# Altium schematic sheet Daughterboard.SchDoc: Digital Daughterboard
size 420 x 297 mm; Date: 03/16/2022; Author: Mamoon Syed; CompanyName: UF PSSL; DrawnBy: Mamoon Syed; Engineer: Mamoon Syed; Organization: University of Florida; DocumentNumber: 1; Revision: 1; SheetNumber: 1; SheetTotal: 1; Time: 1:25 PM; ImagePath: C:\Users\m.syed\Documents\Projects\Electronics Design\Assets\pssl-tag-large.png
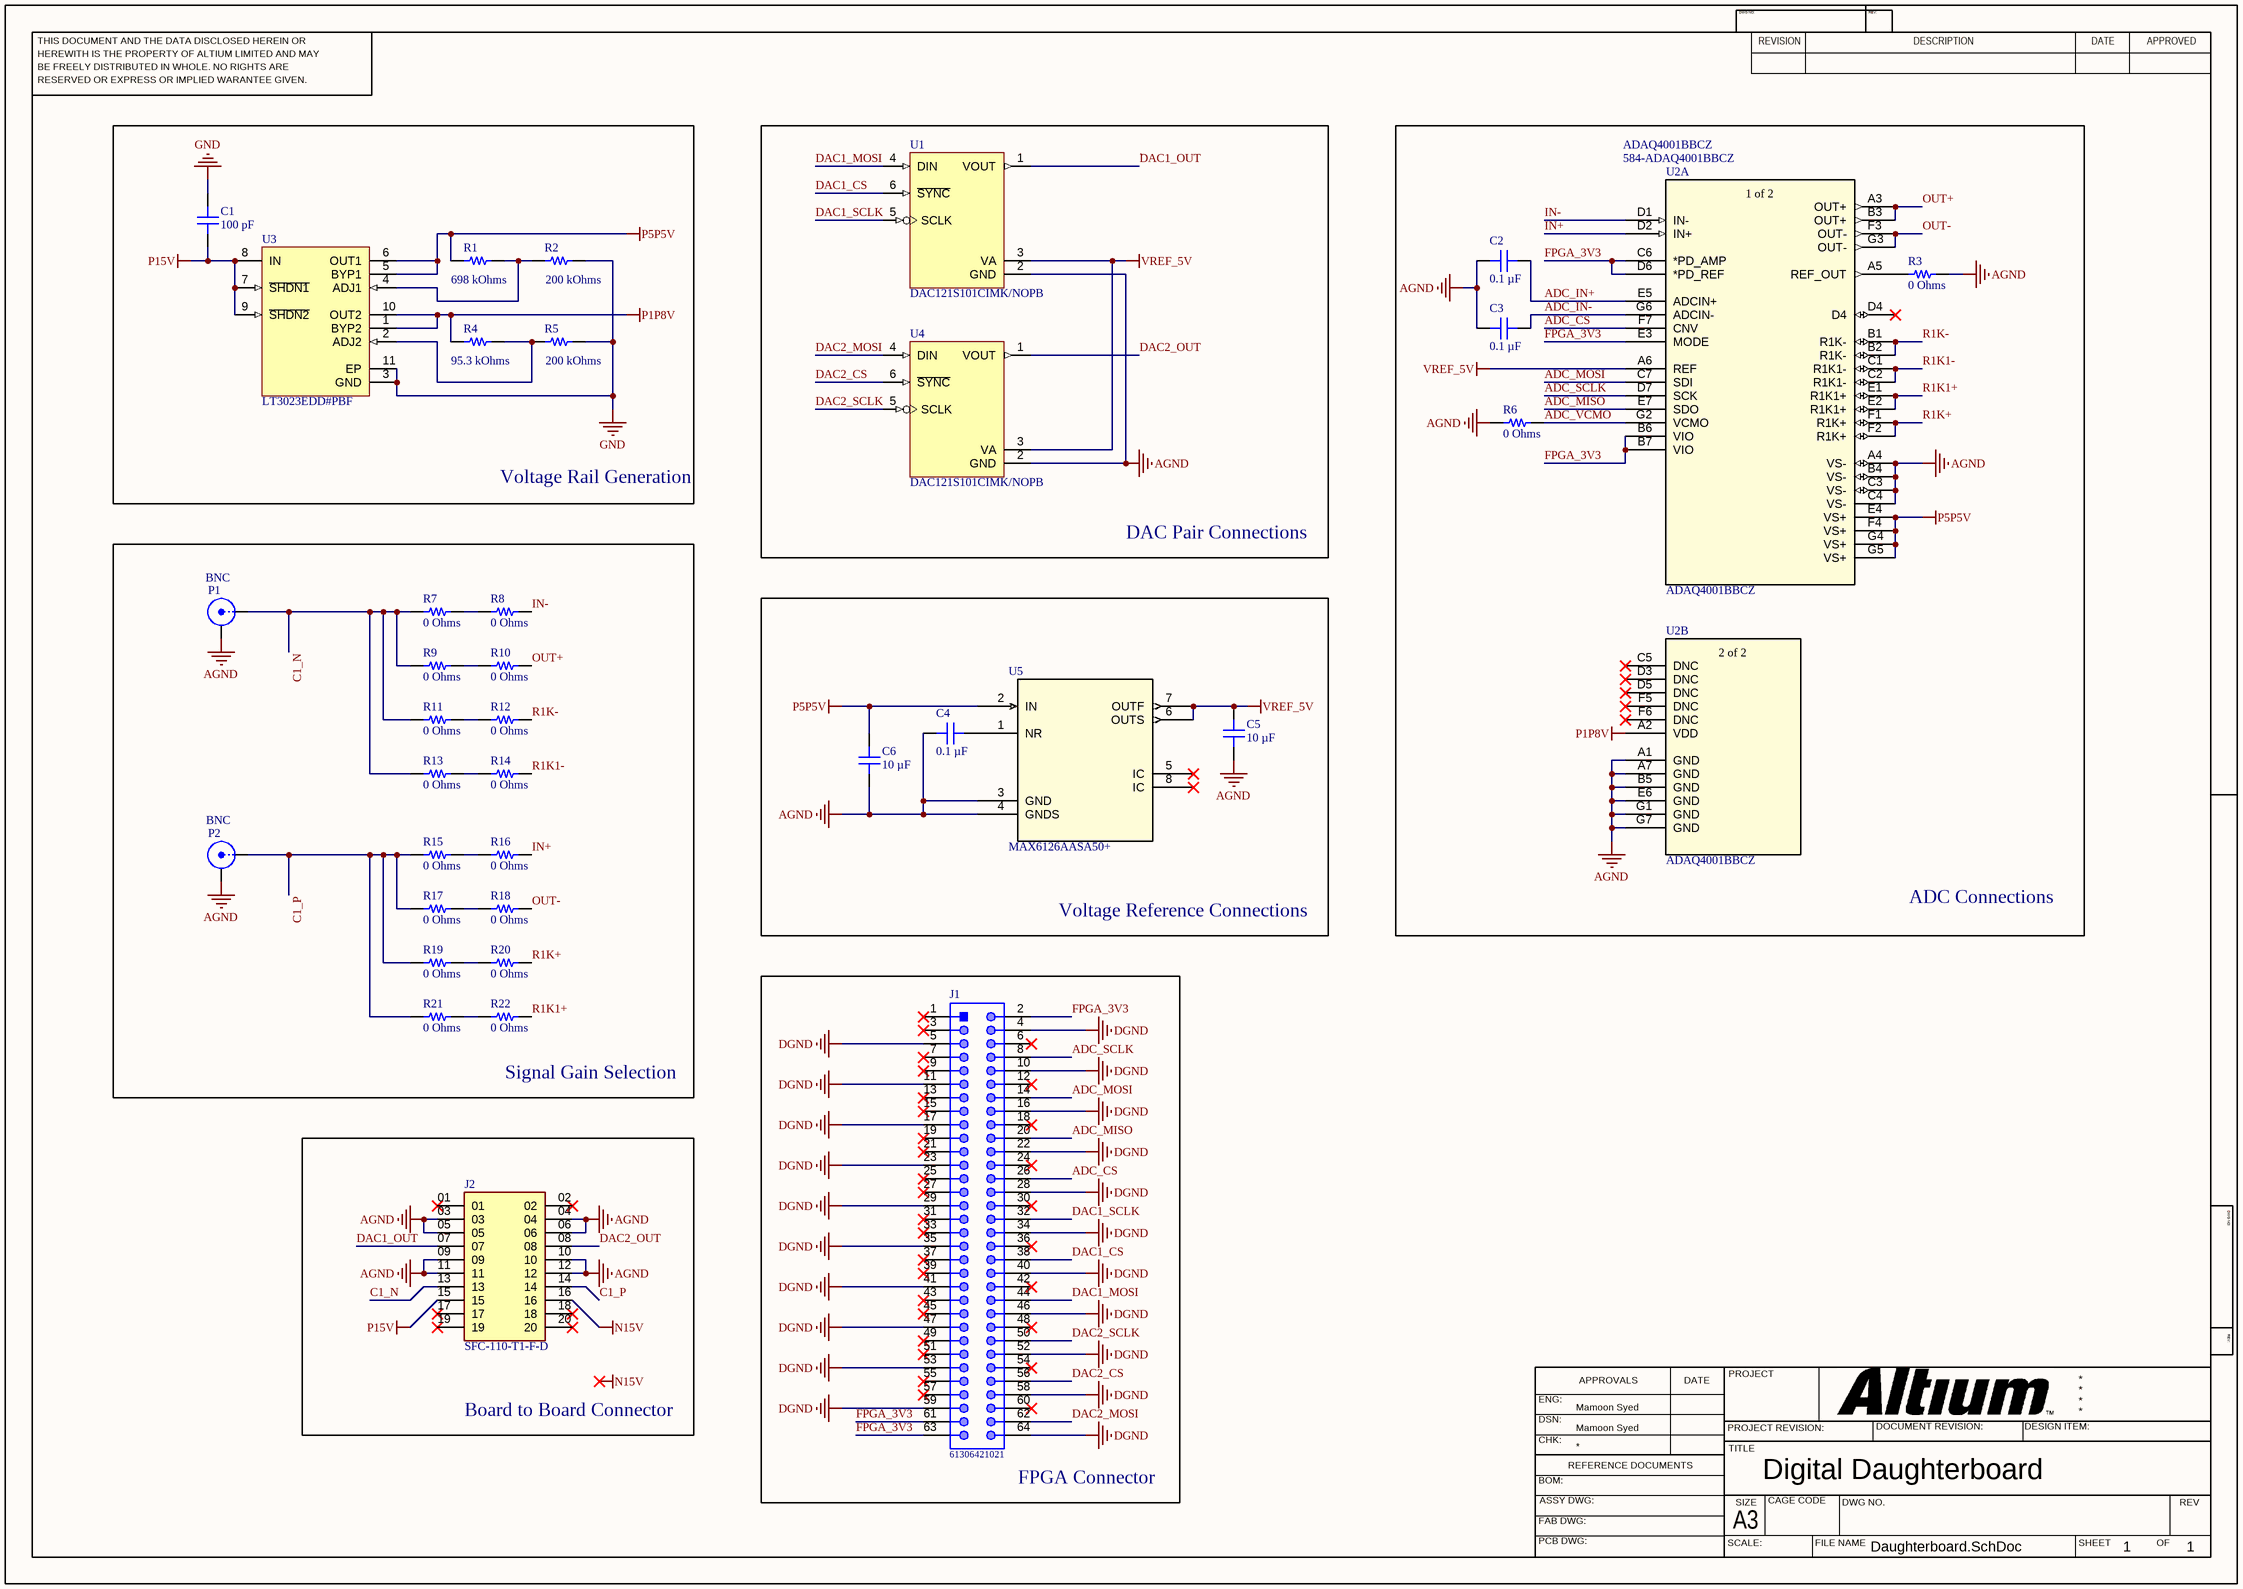
[diagram p0: Daughterboard.SchDoc]

## Parts
C1  100 pF  [CAP 0603_1608]
C2  0.1 µF  [CAP 0603_1608]
C3  0.1 µF  [CAP 0603_1608]
C4  0.1 µF  [CAP 0603_1608]
C5  10 µF  [CAP 0603_1608]
C6  10 µF  [CAP 0603_1608]
J1  61306421021  [61306421021]
J2  SFC-110-T1-F-D  [SAMTEC_SFC-110-T1-F-D]
P1  BNC  [BNC_RA CON]
P2  BNC  [BNC_RA CON]
R1  698 kOhms  [RES 0603_1608]
R2  200 kOhms  [RES 0603_1608]
R3  0 Ohms  [RES 0603_1608]
R4  95.3 kOhms  [RES 0603_1608]
R5  200 kOhms  [RES 0603_1608]
R6  0 Ohms  [RES 0603_1608]
R7  0 Ohms  [RES 0603_1608]
R8  0 Ohms  [RES 0603_1608]
R9  0 Ohms  [RES 0603_1608]
R10  0 Ohms  [RES 0603_1608]
R11  0 Ohms  [RES 0603_1608]
R12  0 Ohms  [RES 0603_1608]
R13  0 Ohms  [RES 0603_1608]
R14  0 Ohms  [RES 0603_1608]
R15  0 Ohms  [RES 0603_1608]
R16  0 Ohms  [RES 0603_1608]
R17  0 Ohms  [RES 0603_1608]
R18  0 Ohms  [RES 0603_1608]
R19  0 Ohms  [RES 0603_1608]
R20  0 Ohms  [RES 0603_1608]
R21  0 Ohms  [RES 0603_1608]
R22  0 Ohms  [RES 0603_1608]
U1  DAC121S101CIMK/NOPB  [MK06A_N]
U2  ADAQ4001BBCZ  Supplier Part Number 1: 584-ADAQ4001BBCZ  [BGA49_ADAQ4001BBCZ_ADI]  (parts A,B of 2)
U3  LT3023EDD#PBF  [LT-DD-10_V]
U4  DAC121S101CIMK/NOPB  [MK06A_N]
U5  MAX6126AASA50+  [21-0041B_8]

## Blocks framed on the sheet
Voltage Rail Generation: C1 R1 R2 R4 R5 U3
DAC Pair Connections: U1 U4
ADC Connections: C2 C3 R3 R6 U2
Signal Gain Selection: P1 P2 R7-R22
Voltage Reference Connections: C4-C6 U5
FPGA Connector: J1
Board to Board Connector: J2

## Nets
AGND: C2.1 C3.1 C4.1 C5.1 C6.1 J2.03 J2.04 J2.05 J2.06 J2.09 J2.10 J2.11 J2.12 P1.2(Y) P2.2(Y) R3.2 R6.1 U1.2(GND) U2.A1(GND) U2.A4(VS-) U2.A7(GND) U2.B4(VS-) U2.B5(GND) U2.C3(VS-) U2.C4(VS-) U2.E6(GND) U2.G1(GND) U2.G7(GND) U4.2(GND) U5.3(GND) U5.4(GNDS)
DGND: J1.4 J1.5 J1.10 J1.11 J1.16 J1.17 J1.22 J1.23 J1.28 J1.29 J1.34 J1.35 J1.40 J1.41 J1.46 J1.47 J1.52 J1.53 J1.58 J1.59 J1.64
GND: C1.2 R2.2 R5.2 U3.3(GND) U3.11(EP)
N15V: J2.16
P1P8V: R4.1 U2.A2(VDD) U3.1(BYP2) U3.10(OUT2)
P5P5V: C6.2 R1.1 U2.E4(VS+) U2.F4(VS+) U2.G4(VS+) U2.G5(VS+) U3.5(BYP1) U3.6(OUT1) U5.2(IN)
P15V: C1.1 J2.15 U3.7(~{SHDN1}) U3.8(IN) U3.9(~{SHDN2})
VREF_5V: C5.2 U1.3(VA) U2.A6(REF) U4.3(VA) U5.6(OUTS) U5.7(OUTF)
`: J2.07 U1.1(VOUT)  [also labelled DAC1_OUT]
ADC_CS: J1.26 U2.F7(CNV)
ADC_IN+: C2.2 U2.E5(ADCIN+)
ADC_IN-: C3.2 U2.G6(ADCIN-)
ADC_MISO: J1.20 U2.E7(SDO)
ADC_MOSI: J1.14 U2.C7(SDI)
ADC_SCLK: J1.8 U2.D7(SCK)
ADC_VCMO: R6.2 U2.G2(VCMO)
C1_N: J2.13 P1.1(X) R7.1 R9.1 R11.1 R13.1
C1_P: J2.14 P2.1(X) R15.1 R17.1 R19.1 R21.1
DAC1_CS: J1.38 U1.6(~{SYNC})
DAC1_MOSI: J1.44 U1.4(DIN)
DAC1_SCLK: J1.32 U1.5(SCLK)
DAC2_CS: J1.56 U4.6(~{SYNC})
DAC2_MOSI: J1.62 U4.4(DIN)
DAC2_OUT: J2.08 U4.1(VOUT)
DAC2_SCLK: J1.50 U4.5(SCLK)
FPGA_3V3: J1.2 J1.61 J1.63 U2.B6(VIO) U2.B7(VIO) U2.C6(*PD_AMP) U2.D6(*PD_REF) U2.E3(MODE)
IN+: R16.2 U2.D2(IN+)
IN-: R8.2 U2.D1(IN-)
OUT+: R10.2 U2.A3(OUT+) U2.B3(OUT+)
OUT-: R18.2 U2.F3(OUT-) U2.G3(OUT-)
R1K1+: R22.2 U2.E1(R1K1+) U2.E2(R1K1+)
R1K1-: R14.2 U2.C1(R1K1-) U2.C2(R1K1-)
R1K+: R20.2 U2.F1(R1K+) U2.F2(R1K+)
R1K-: R12.2 U2.B1(R1K-) U2.B2(R1K-)
NetC4_2: C4.2 U5.1(NR)
NetR1_2: R1.2 R2.1 U3.4(ADJ1)
NetR3_1: R3.1 U2.A5(REF_OUT)
NetR4_2: R4.2 R5.1 U3.2(ADJ2)
NetR7_2: R7.2 R8.1
NetR9_2: R9.2 R10.1
NetR11_2: R11.2 R12.1
NetR13_2: R13.2 R14.1
NetR15_2: R15.2 R16.1
NetR17_2: R17.2 R18.1
NetR19_2: R19.2 R20.1
NetR21_2: R21.2 R22.1

Not connected (* = marked no-connect by the designer): J1 1* 3* 6* 7* 9* 12* 13* 15* 18* 19* 21* 24* 25* 27* 30* 31* 33* 36* 37* 39* 42* 43* 45* 48* 49* 51* 54* 55* 57* 60*; J2 01* 02* 17* 18* 19* 20*; U2 C5(DNC)* D3(DNC)* D4* D5(DNC)* F5(DNC)* F6(DNC)*; U5 5(IC)* 8(IC)*

## Notes on the sheet
- Labels drawn without touching a wire or pin: N15V
- THIS DOCUMENT AND THE DATA DISCLOSED HEREIN OR
- HEREWITH IS THE PROPERTY OF ALTIUM LIMITED AND MAY
- DWG NO:
- REVISION
- REV:
- DESCRIPTION
- DATE
- APPROVED
- BE FREELY DISTRIBUTED IN WHOLE. NO RIGHTS ARE
- RESERVED OR EXPRESS OR IMPLIED WARANTEE GIVEN.
- ENG:
- APPROVALS
- PROJECT
- DSN:
- CHK:
- REFERENCE DOCUMENTS
- PROJECT REVISION:
- TITLE
- DOCUMENT REVISION:
- DESIGN ITEM:
- BOM:
- FAB DWG:
- PCB DWG:
- ASSY DWG:
- SCALE:
- A3
- SIZE
- CAGE CODE
- FILE NAME
- DWG NO.
- SHEET
- OF
- REV
- (in symbol ADAQ4001BBCZ, part A) 1 of 2
- (in symbol ADAQ4001BBCZ, part B) 2 of 2

## Library data of the parts
C1 = C0603C101K5GACAUTO: CAP CER 100PF 50V C0G/NP0 0603; manufacturer: KEMET; Temperature Coefficient: C0G, NP0; Tolerance: ±10%; Part Number: C0603C101K5GACAUTO; Value: 100 pF; Applications: Automotive; Capacitance: 100 pF; componentlink1description: Datasheet; componentlink1url: https://api.kemet.com/component-edge/download/datasheet/C0603C101K5GACAUTO.pdf; componentlink2description: DigiKey Link; componentlink2url: https://www.digikey.com/en/products/detail/kemet/C0603C101K5GACAUTO/3314842; Device Package: 0603 (1608 Metric); Features: Low ESL; lastupdated: 4/12/2022 10:08:31 PM; Lifecycle Status: Active; Minimum Order: 1; Mounting Type: Surface Mount, MLCC; Operating Temperature: -55°C ~ 125°C; Package / Case: 0603 (1608 Metric); packaging: TapeAndReel; partid: 2201; Part Status: Active; price: 0.02; Ratings: AEC-Q200; series: SMD Auto C0G; Size / Dimension: 0.063" L x 0.031" W (1.60mm x 0.80mm); Supplier 1: DigiKey; Supplier Part Number 1: 399-6843-1-ND; Thickness (Max): 0.034" (0.87mm); Voltage - Rated: 50V
C2-C4 = C0603C104K5RAC7411: CAP CER 0.1UF 50V X7R 0603; manufacturer: KEMET; Tolerance: ±10%; Part Number: C0603C104K5RAC7411; Value: 0.1 µF; Applications: Bypass, Decoupling; Capacitance: 0.1 µF; componentlink1description: Datasheet; componentlink1url: https://api.kemet.com/component-edge/download/datasheet/C0603C104K5RAC7411.pdf; componentlink2description: DigiKey Link; componentlink2url: https://www.digikey.com/en/products/detail/kemet/C0603C104K5RAC7411/3317013; Device Package: 0603 (1608 Metric); lastupdated: 4/12/2022 10:08:31 PM; Lifecycle Status: Active; Minimum Order: 15000; Mounting Type: Surface Mount, MLCC; Operating Temperature: -55°C ~ 125°C; Package / Case: 0603 (1608 Metric); packaging: TapeAndReel; partid: 2233; Part Status: Active; price: 0.01; series: SMD Comm X7R; Size / Dimension: 0.063" L x 0.031" W (1.60mm x 0.80mm); Supplier 1: DigiKey; Supplier Part Number 1: 399-7374-2-ND; Temperature Coefficient: X7R; Thickness (Max): 0.035" (0.90mm); Voltage - Rated: 50V
C5 C6 = GRM188R60J106ME47D: CAP CER 10UF 6.3V X5R 0603; manufacturer: Murata Electronics; Tolerance: ±20%; Part Number: GRM188R60J106ME47D; Value: 10 µF; Applications: General Purpose; Capacitance: 10 µF; componentlink1description: Datasheet; componentlink1url: https://www.murata.com/~/media/webrenewal/support/library/catalog/products/capacitor/mlcc/c02e.ashx?la=en-us; componentlink2description: DigiKey Link; componentlink2url: https://www.digikey.com/en/products/detail/murata-electronics/GRM188R60J106ME47D/965910; Device Package: 0603 (1608 Metric); lastupdated: 4/12/2022 10:08:30 PM; Lifecycle Status: Active; Minimum Order: 1; Mounting Type: Surface Mount, MLCC; Operating Temperature: -55°C ~ 85°C; Package / Case: 0603 (1608 Metric); packaging: TapeAndReel; partid: 2351; Part Status: Active; price: 0.03; series: GRM; Size / Dimension: 0.063" L x 0.031" W (1.60mm x 0.80mm); Supplier 1: DigiKey; Supplier Part Number 1: 490-3896-1-ND; Temperature Coefficient: X5R; Thickness (Max): 0.035" (0.90mm); Voltage - Rated: 6.3V
J1 = CMP-1502-01137-1: THT Angled Pin Header WR-PHD, Pitch 2.54 mm, Dual Row, 64 pins; Manufacturer: Wurth Elektronik; Working Voltage: 250VAC; Contact Resistance: 20mOhm; Rated Current: 3A; Pitch: 2.54mm; Pin Number: 64; Gender: Male; Withstanding Voltage: 500VAC; Row Number: Dual; Datasheet URL: https://katalog.we-online.de/em/datasheet/6130xx21021.pdf; Packaging: Bag; Package Reference: 61306421021; Part Number: 61306421021; Mounting Technology: THT; Manufacturer URL: http://www.we-online.de; Orientation: Angled; Publisher: WurthElektronik; Operating Temperature: -40to105degC
P1 P2 = BNC: BNC Elbow Connector; LatestRevisionDate: 17-Jul-2002; LatestRevisionNote: Re-released for DXP Platform.; Publisher: Altium Limited
R1 = RC0603FR-07698KL: RES 698K OHM 1% 1/10W 0603; Manufacturer: Yageo; Power (Watts): 0.1W, 1/10W; Temperature Coefficient: ±100ppm/°C; Part Number: RC0603FR-07698KL; Value: 698 kOhms; ComponentLink1Description: Datasheet; ComponentLink1URL: https://www.yageo.com/upload/media/product/productsearch/datasheet/rchip/PYu-RC_Group_51_RoHS_L_10.pdf; ComponentLink2Description: DigiKey Link; ComponentLink2URL: https://www.digikey.com/en/products/detail/yageo/RC0603FR-07698KL/727362; Composition: Thick Film; Device Package: 0603 (1608 Metric); Features: Moisture Resistant; Height - Seated (Max): 0.022" (0.55mm); LastUpdated: 4/12/2022 10:26:44 PM; Lifecycle Status: Active; Minimum Order: 1; Number of Terminations: 2; Operating Temperature: -55°C ~ 155°C; Package / Case: 0603 (1608 Metric); Packaging: CutTape; PartId: 22804; Part Status: Active; Price: 0.01; Resistance: 698 kOhms; Series: RC_L; Size / Dimension: 0.063" L x 0.031" W (1.60mm x 0.80mm); Supplier 1: DigiKey; Supplier Part Number 1: 311-698KHRCT-ND; Supplier Device Package: 0603; Tolerance: ±1%
R2 R5 = RK73B1JTTD204J: RES 200K OHM 5% 1/10W 0603; Manufacturer: KOA Speer Electronics, Inc.; Power (Watts): 0.1W, 1/10W; Temperature Coefficient: ±200ppm/°C; Part Number: RK73B1JTTD204J; Value: 200 kOhms; ComponentLink1Description: Datasheet; ComponentLink1URL: http://www.koaspeer.com/catimages/Products/RK73B/RK73B.pdf; ComponentLink2Description: DigiKey Link; ComponentLink2URL: https://www.digikey.com/en/products/detail/koa-speer-electronics-inc/RK73B1JTTD204J/9844774; Composition: Thick Film; Device Package: 0603 (1608 Metric); Features: Automotive AEC-Q200; Height - Seated (Max): 0.022" (0.55mm); LastUpdated: 4/12/2022 10:27:51 PM; Lifecycle Status: Active; Minimum Order: 1; Number of Terminations: 2; Operating Temperature: -55°C ~ 155°C; Package / Case: 0603 (1608 Metric); Packaging: CutTape; PartId: 6049; Part Status: Active; Price: 0.01; Ratings: AEC-Q200; Resistance: 200 kOhms; Series: RK73B; Size / Dimension: 0.063" L x 0.031" W (1.60mm x 0.80mm); Supplier 1: DigiKey; Supplier Part Number 1: 2019-RK73B1JTTD204JCT-ND; Supplier Device Package: 0603; Tolerance: ±5%
R3 R6-R22 = AC0603JR-070RL: RES SMD 0 OHM JUMPER 1/10W 0603; Manufacturer: Yageo; Power (Watts): 0.1W, 1/10W; Part Number: AC0603JR-070RL; Value: 0 Ohms; ComponentLink1Description: Datasheet; ComponentLink1URL: https://www.yageo.com/upload/media/product/productsearch/datasheet/rchip/PYu-AC_51_RoHS_L_7.pdf; ComponentLink2Description: DigiKey Link; ComponentLink2URL: https://www.digikey.com/en/products/detail/yageo/AC0603JR-070RL/2827828; Composition: Thick Film; Device Package: 0603 (1608 Metric); Features: Automotive AEC-Q200, Moisture Resistant; Height - Seated (Max): 0.022" (0.55mm); LastUpdated: 4/12/2022 10:26:34 PM; Lifecycle Status: Active; Minimum Order: 1; Number of Terminations: 2; Operating Temperature: -55°C ~ 155°C; Package / Case: 0603 (1608 Metric); Packaging: CutTape; PartId: 23964; Part Status: Active; Price: 0.01; Ratings: AEC-Q200; Resistance: 0 Ohms; Series: AC; Size / Dimension: 0.063" L x 0.031" W (1.60mm x 0.80mm); Supplier 1: DigiKey; Supplier Part Number 1: 311-0.0LECT-ND; Supplier Device Package: 0603; Tolerance: Jumper
R4 = RC0603FR-0795K3L: RES 95.3K OHM 1% 1/10W 0603; Manufacturer: Yageo; Power (Watts): 0.1W, 1/10W; Temperature Coefficient: ±100ppm/°C; Part Number: RC0603FR-0795K3L; Value: 95.3 kOhms; ComponentLink1Description: Datasheet; ComponentLink1URL: https://www.yageo.com/upload/media/product/productsearch/datasheet/rchip/PYu-RC_Group_51_RoHS_L_10.pdf; ComponentLink2Description: DigiKey Link; ComponentLink2URL: https://www.digikey.com/en/products/detail/yageo/RC0603FR-0795K3L/727436; Composition: Thick Film; Device Package: 0603 (1608 Metric); Features: Moisture Resistant; Height - Seated (Max): 0.022" (0.55mm); LastUpdated: 4/12/2022 10:27:26 PM; Lifecycle Status: Active; Minimum Order: 1; Number of Terminations: 2; Operating Temperature: -55°C ~ 155°C; Package / Case: 0603 (1608 Metric); Packaging: CutTape; PartId: 12452; Part Status: Active; Price: 0.01; Resistance: 95.3 kOhms; Series: RC_L; Size / Dimension: 0.063" L x 0.031" W (1.60mm x 0.80mm); Supplier 1: DigiKey; Supplier Part Number 1: 311-95.3KHRCT-ND; Supplier Device Package: 0603; Tolerance: ±1%
U1 U4 = CMP-0061-00064-2: 12-Bit Micro Power, RRO Digital-to-Analog Converter, 6-pin Tiny SOT23, Pb-Free; Manufacturer: National Semiconductor; PackageTopMarking: X61C*XTT; CompType: D/A Converter; PowerWise: Y; PinCount: 6; ComponentLink1URL: http://www.national.com/ds/DA/DAC121S101.pdf; Code_JEDEC: MO-193-AA; Code_IPC: SOT26A-6; PackageReference: MK06A; ComponentLink2Description: DAC121S101 Web Page; PackageDescription: Molded TSOT, 2.97 x 1.65 x 0.87mm Body, 6 Lead, 0.95mm Pitch; ComponentLink3Description: MK06A Package Page; ComponentLink1Description: DAC121S101 Datasheet; RoHS: Y; ComponentLink3URL: http://www.national.com/packaging/folders/mk06a.html; PackageVersion: revE, Nov-2008; RevisionNote: Component URLs added; DatasheetVersion: Feb-2010; ComponentLink2URL: http://www.national.com/pf/DA/DAC121S101.html
U2 = ADAQ4001BBCZ: Analog Devices ADAQ4001 - 16-Bit Sequential Approximation ADC; Mfr_Name: Analog Devices Inc; Copyright: Copyright (C) 2022 Ultra Librarian. All rights reserved.; Manufacturer_Part_Number: ADAQ4001BBCZ; RefDes: RefDes; Type: DEV; Supplier 1: Mouser; Supplier 2: Arrow Electronics; Supplier Part Number 2: ADAQ4001BBCZ
U3 = CMP-0476-00173-1: Dual 100 mA, Low Dropout, Low Noise, Micropower Regulator, 1.8 to 20 V Vin, Adjustable Vout, 10-pin SON (DD-10), -40 to 125 degC, Pb-Free; Manufacturer: Linear Technology; Number of Outputs: 2; Output Voltage: Adj; Noise(uV): 20; Iout(mA): 100; Dropout Voltage(V): 0.3; Discrete Pass Element: no; Vin Min(V): 1.8; Shutdown Current(uA): 0.1; Isupply(mA): 0.02; Vout Min(V): 1.22; PSRR(dB): 65; PartNumber: LT3023EDD#PBF; ComponentLink2Description: Datasheet; DatasheetVersion: Rev. A; Mounting Technology: Surface Mount; PackageVersion: Rev. C, 06/2010; Code_JEDEC: MO-229; Vout Max(V): 20; RoHS: TRUE; ComponentLink3Description: Package Specification; ComponentLink1Description: Manufacturer URL; Vin Max(V): 20; PackageDescription: 10-Pin Plastic DFN, Body 3 x 3 mm, Pitch 0.5 mm; ComponentLink3URL: http://cds.linear.com/docs/en/packaging/DFN_10_05-08-1699.pdf; ComponentLink2URL: http://cds.linear.com/docs/en/datasheet/3023fa.pdf; PackageReference: DD-10; ComponentLink1URL: http://www.linear.com/
U5 = MAX6126AASA50+: MAX6126AASA50+ Voltage Reference; Mfr_Name: Maxim Integrated Products; Copyright: Copyright (C) 2022 Ultra Librarian. All rights reserved.; Manufacturer_Part_Number: MAX6126AASA50+; RefDes: RefDes; Type: DEV
J2 = SFC-110-T1-F-D: MP: SFC-110-T1-F-D; Price: None; Package: None; Availability: Unavailable; Value: *